# Altium schematic sheet LDO.SchDoc
size A4; SheetNumber: 11; SheetTotal: 11
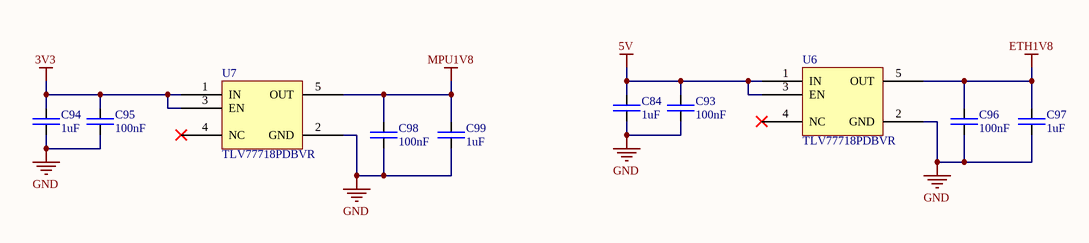
[diagram p0: LDO.SchDoc]

## Parts
C84  1uF  [CAP-0805]
C93  100nF  [CAP-0603]
C94  1uF  [CAP-0805]
C95  100nF  [CAP-0603]
C96  100nF  [CAP-0603]
C97  1uF  [CAP-0805]
C98  100nF  [CAP-0603]
C99  1uF  [CAP-0805]
U6  TLV77718PDBVR  [TLV77718PDBVR]
U7  TLV77718PDBVR  [TLV77718PDBVR]

## Nets
3V3: C94.2 C95.2 U7.1(IN) U7.3(EN)
5V: C84.2 C93.2 U6.1(IN) U6.3(EN)
ETH1V8: C96.2 C97.2 U6.5(OUT)
GND: C84.1 C93.1 C94.1 C95.1 C96.1 C97.1 C98.1 C99.1 U6.2(GND) U7.2(GND)
MPU1V8: C98.2 C99.2 U7.5(OUT)

Not connected (* = marked no-connect by the designer): U6 4(NC)*; U7 4(NC)*

## Library data of the parts
C84 C94 C97 C99 = CAP-0805: Capacitor chip unpolarized. 0805
C93 C95 C96 C98 = CAP-0603: Capacitor chip unpolarized. 0603
U6 U7 = TLV77718PDBVR: LDO 1.8V 1A